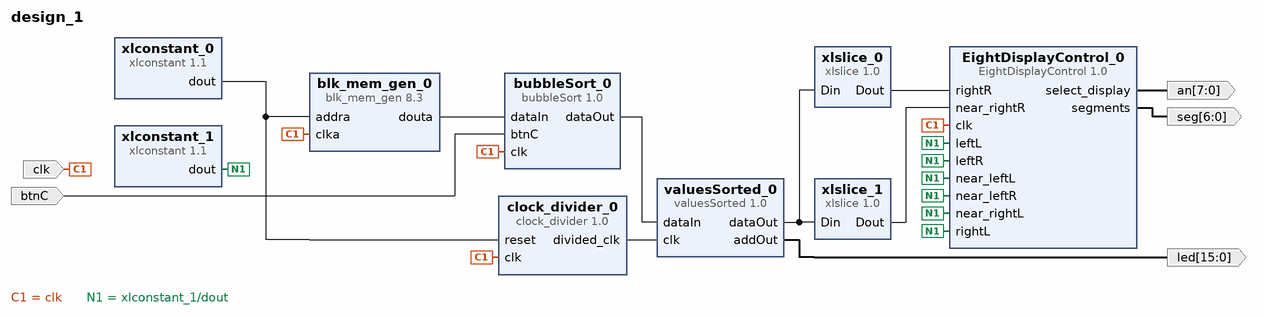
[diagram p0: block diagram of the top level]
# Vivado block design design_1, xc7a100tcsg324-1, Vivado 2016.4
create_bd_design design_1

create_bd_port -dir I -type clk clk
create_bd_port -dir I -type rst btnC
set_property -dict {CONFIG.POLARITY ACTIVE_HIGH} [get_bd_ports btnC]
create_bd_port -dir O -from 7 -to 0 an
create_bd_port -dir O -from 6 -to 0 seg
create_bd_port -dir O -from 15 -to 0 led

create_bd_cell -type ip -vlnv xilinx.com:user:clock_divider:1.0 clock_divider_0
set_property -dict {CONFIG.how_fast 26} [get_bd_cells clock_divider_0]
create_bd_cell -type ip -vlnv xilinx.com:user:valuesSorted:1.0 valuesSorted_0
set_property -dict {CONFIG.n_words 16} [get_bd_cells valuesSorted_0]
create_bd_cell -type ip -vlnv xilinx.com:user:bubbleSort:1.0 bubbleSort_0
set_property -dict {CONFIG.number_of_bits_p_w 8 CONFIG.number_of_words 16} [get_bd_cells bubbleSort_0]
create_bd_cell -type ip -vlnv xilinx.com:ip:xlconstant:1.1 xlconstant_0
set_property -dict {CONFIG.CONST_VAL 0} [get_bd_cells xlconstant_0]
create_bd_cell -type ip -vlnv xilinx.com:ip:blk_mem_gen:8.3 blk_mem_gen_0
set_property -dict [list \
  CONFIG.Memory_Type Single_Port_ROM \
  CONFIG.Enable_32bit_Address false \
  CONFIG.Write_Width_A 128 \
  CONFIG.Enable_A Always_Enabled \
  CONFIG.Register_PortA_Output_of_Memory_Primitives false \
  CONFIG.Load_Init_File true \
  CONFIG.Coe_File ../../../../../../../../Aula3/Aula3_estudo_ex4/coe/aula6_ex7.coe \
  CONFIG.Use_RSTA_Pin false \
  CONFIG.Port_A_Write_Rate 0 \
  CONFIG.use_bram_block Stand_Alone \
] [get_bd_cells blk_mem_gen_0]
create_bd_cell -type ip -vlnv xilinx.com:user:EightDisplayControl:1.0 EightDisplayControl_0
create_bd_cell -type ip -vlnv xilinx.com:ip:xlslice:1.0 xlslice_0
set_property -dict {CONFIG.DOUT_WIDTH 4 CONFIG.DIN_TO 0 CONFIG.DIN_FROM 3 CONFIG.DIN_WIDTH 8} [get_bd_cells xlslice_0]
create_bd_cell -type ip -vlnv xilinx.com:ip:xlslice:1.0 xlslice_1
set_property -dict {CONFIG.DOUT_WIDTH 4 CONFIG.DIN_TO 4 CONFIG.DIN_FROM 7 CONFIG.DIN_WIDTH 8} [get_bd_cells xlslice_1]
create_bd_cell -type ip -vlnv xilinx.com:ip:xlconstant:1.1 xlconstant_1
set_property -dict {CONFIG.CONST_WIDTH 4 CONFIG.CONST_VAL 0} [get_bd_cells xlconstant_1]

# ---- connections ----

connect_bd_net [get_bd_ports clk] \
  [get_bd_pins clock_divider_0/clk] [get_bd_pins bubbleSort_0/clk] [get_bd_pins blk_mem_gen_0/clka] \
  [get_bd_pins EightDisplayControl_0/clk]
connect_bd_net [get_bd_pins clock_divider_0/divided_clk] [get_bd_pins valuesSorted_0/clk]
connect_bd_net [get_bd_pins bubbleSort_0/dataOut] [get_bd_pins valuesSorted_0/dataIn]
connect_bd_net [get_bd_ports btnC] [get_bd_pins bubbleSort_0/btnC]
connect_bd_net [get_bd_pins xlconstant_0/dout] [get_bd_pins clock_divider_0/reset] [get_bd_pins blk_mem_gen_0/addra]
connect_bd_net [get_bd_pins blk_mem_gen_0/douta] [get_bd_pins bubbleSort_0/dataIn]
connect_bd_net [get_bd_pins valuesSorted_0/dataOut] [get_bd_pins xlslice_0/Din] [get_bd_pins xlslice_1/Din]
connect_bd_net [get_bd_pins xlslice_0/Dout] [get_bd_pins EightDisplayControl_0/rightR]
connect_bd_net [get_bd_pins xlslice_1/Dout] [get_bd_pins EightDisplayControl_0/near_rightR]
connect_bd_net [get_bd_pins EightDisplayControl_0/select_display] [get_bd_ports an]
connect_bd_net [get_bd_pins EightDisplayControl_0/segments] [get_bd_ports seg]
connect_bd_net [get_bd_pins xlconstant_1/dout] \
  [get_bd_pins EightDisplayControl_0/near_leftR] [get_bd_pins EightDisplayControl_0/leftR] \
  [get_bd_pins EightDisplayControl_0/rightL] [get_bd_pins EightDisplayControl_0/near_rightL] \
  [get_bd_pins EightDisplayControl_0/near_leftL] [get_bd_pins EightDisplayControl_0/leftL]
connect_bd_net [get_bd_pins valuesSorted_0/addOut] [get_bd_ports led]

validate_bd_design
save_bd_design
